# Altium schematic sheet Microcontroller.SchDoc
size A4; DocumentNumber: 11; SheetNumber: ALT0056; SheetTotal: 21
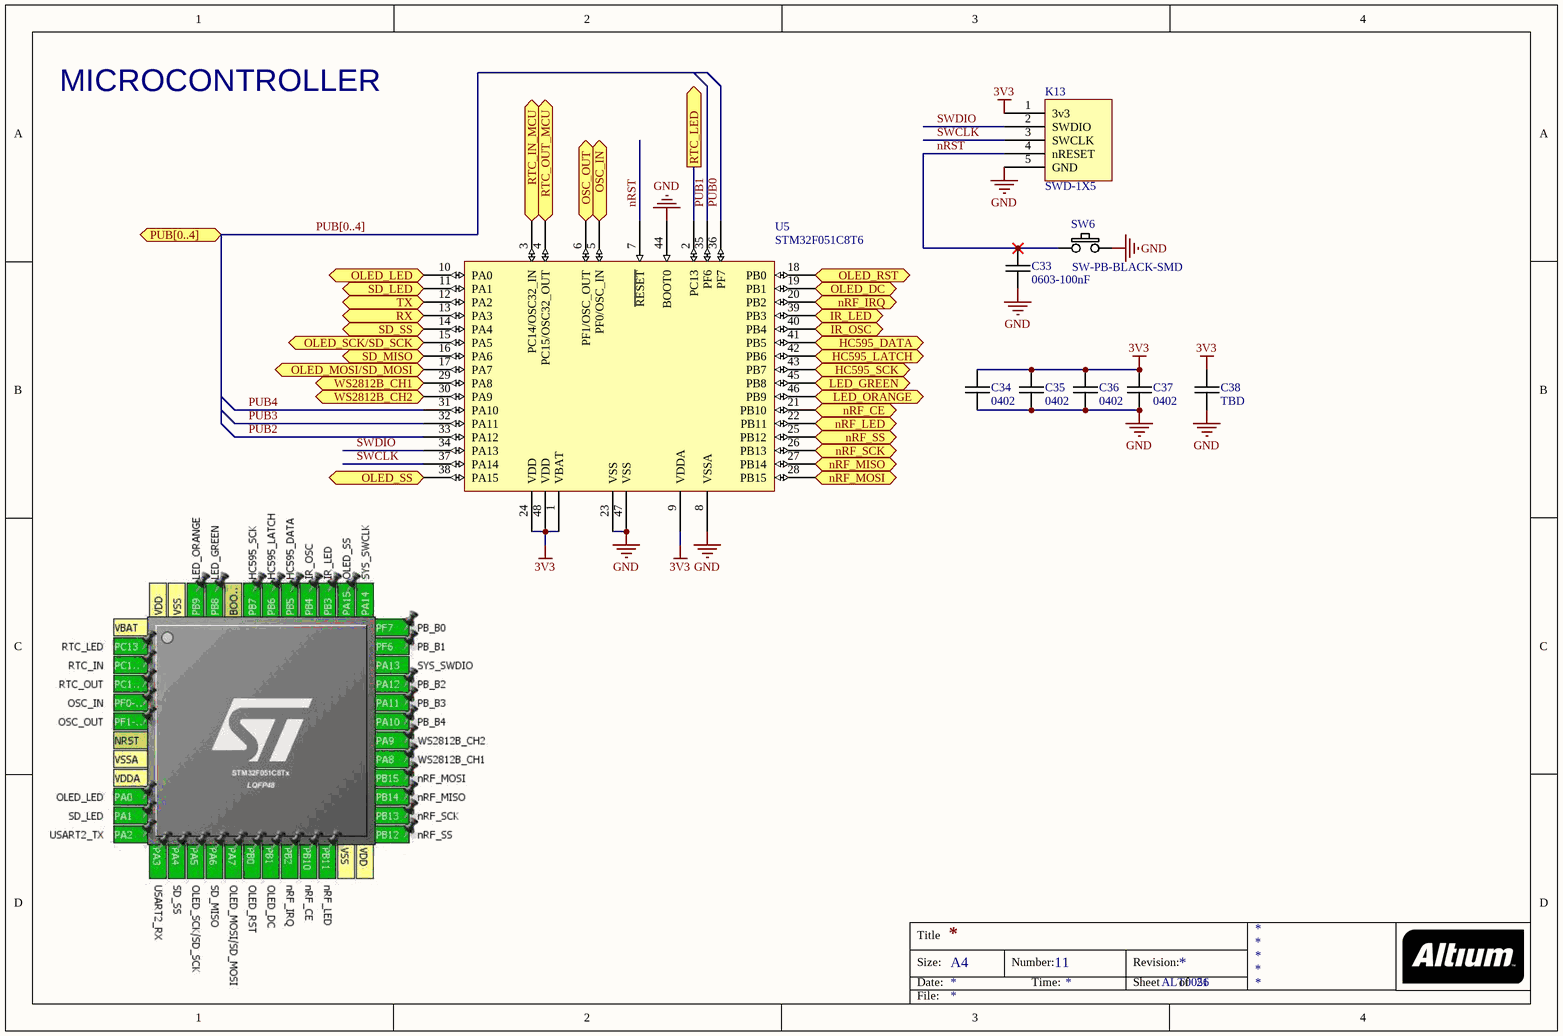
[diagram p0: Microcontroller.SchDoc]

## Parts
C33  0603-100nF  [0603C-TBD]
C34  0402  [0402C-TBD]
C35  0402  [0402C-TBD]
C36  0402  [0402C-TBD]
C37  0402  [0402C-TBD]
C38  TBD  [1210C-GENERIC]
K13  SWD-1X5  [HEADER-1X5]
SW6  SW-PB-BLACK-SMD  [SW-PB-SMD]
U5  STM32F051C8T6  [LQFP48_N]

## Ports
HC595_DATA (out), HC595_LATCH (out), HC595_SCK (out), IR_LED (out), IR_OSC (out), LED_GREEN (out), LED_ORANGE (out), nRF_CE (out), nRF_IRQ (in), nRF_LED (out), nRF_MISO (in), nRF_MOSI (out), nRF_SCK (out), nRF_SS (out), OLED_DC (out), OLED_LED (out), OLED_MOSI/SD_MOSI (out), OLED_RST (out), OLED_SCK/SD_SCK (out), OLED_SS (out), OSC_IN (in), OSC_OUT (out), PUB[0..4] (in), RTC_IN_MCU (in), RTC_LED (out), RTC_OUT_MCU (out), RX (in), SD_LED (out), SD_MISO (in), SD_SS (out), TX (out), WS2812B_CH1 (out), WS2812B_CH2 (out)

## Nets
3V3: C34.1 C35.1 C36.1 C37.1 C38.1 K13.1(3v3) U5.1(VBAT) U5.9(VDDA) U5.24(VDD) U5.48(VDD)
GND: C33.2 C34.2 C35.2 C36.2 C37.2 C38.2 K13.5(GND) SW6.2 U5.8(VSSA) U5.23(VSS) U5.44(BOOT0) U5.47(VSS)
HC595_DATA: U5.41(PB5) ; port HC595_DATA
HC595_LATCH: U5.42(PB6) ; port HC595_LATCH
HC595_SCK: U5.43(PB7) ; port HC595_SCK
IR_LED: U5.39(PB3) ; port IR_LED
IR_OSC: U5.40(PB4) ; port IR_OSC
LED_GREEN: U5.45(PB8) ; port LED_GREEN
LED_ORANGE: U5.46(PB9) ; port LED_ORANGE
nRF_CE: U5.21(PB10) ; port nRF_CE
nRF_IRQ: U5.20(PB2) ; port nRF_IRQ
nRF_LED: U5.22(PB11) ; port nRF_LED
nRF_MISO: U5.27(PB14) ; port nRF_MISO
nRF_MOSI: U5.28(PB15) ; port nRF_MOSI
nRF_SCK: U5.26(PB13) ; port nRF_SCK
nRF_SS: U5.25(PB12) ; port nRF_SS
nRST: C33.1 K13.4(nRESET) SW6.1 U5.7(~{RESET})
OLED_DC: U5.19(PB1) ; port OLED_DC
OLED_LED: U5.10(PA0) ; port OLED_LED
OLED_MOSI/SD_MOSI: U5.17(PA7) ; port OLED_MOSI/SD_MOSI
OLED_RST: U5.18(PB0) ; port OLED_RST
OLED_SCK/SD_SCK: U5.15(PA5) ; port OLED_SCK/SD_SCK
OLED_SS: U5.38(PA15) ; port OLED_SS
OSC_IN: U5.5(PF0/OSC_IN) ; port OSC_IN
OSC_OUT: U5.6(PF1/OSC_OUT) ; port OSC_OUT
PUB0: U5.36(PF7)
PUB1: U5.35(PF6)
PUB2: U5.33(PA12)
PUB3: U5.32(PA11)
PUB4: U5.31(PA10)
RTC_IN_MCU: U5.3(PC14/OSC32_IN) ; port RTC_IN_MCU
RTC_LED: U5.2(PC13) ; port RTC_LED
RTC_OUT_MCU: U5.4(PC15/OSC32_OUT) ; port RTC_OUT_MCU
RX: U5.13(PA3) ; port RX
SD_LED: U5.11(PA1) ; port SD_LED
SD_MISO: U5.16(PA6) ; port SD_MISO
SD_SS: U5.14(PA4) ; port SD_SS
SWCLK: K13.3(SWCLK) U5.37(PA14)
SWDIO: K13.2(SWDIO) U5.34(PA13)
TX: U5.12(PA2) ; port TX
WS2812B_CH1: U5.29(PA8) ; port WS2812B_CH1
WS2812B_CH2: U5.30(PA9) ; port WS2812B_CH2

## Buses and harness runs
bus PUB[0..4] = port PUB[0..4]

## Notes on the sheet
- MICROCONTROLLER
- Title
- Size:
- Date:
- A4
- Number:
- Time:
- Revision:
- Sheet
- of
- File:

## Library data of the parts
C33 = 0603C-TBD: CAPACITOR 0603 CERAMIC VALUE TO BE DETERMINED; REEL: *
C34-C37 = 0402C-TBD: CAPACITOR 0402 CERAMIC
C38 = Passives_Capacitors_1210_1210C-TBD: CAPACITOR 1210 CERAMIC VALUE TO BE DETERMINED
K13 = SWD-1X5: SWD PINHEADER 1X5; REEL: TH; Supplier 1: Digi-Key; Supplier Part Number 1: S1011E-36-ND
SW6 = SW-PB-BLACK-SMD: PUSHBUTTON SWITCH 6MM SMD